# Altium project B108AA.PrjPcb (part 4 of 4)

## Sheet MicroController USB to UART Converter.SchDoc: USB to UART Converter
size 292 x 193 mm; SheetNumber: 39; SheetTotal: 40
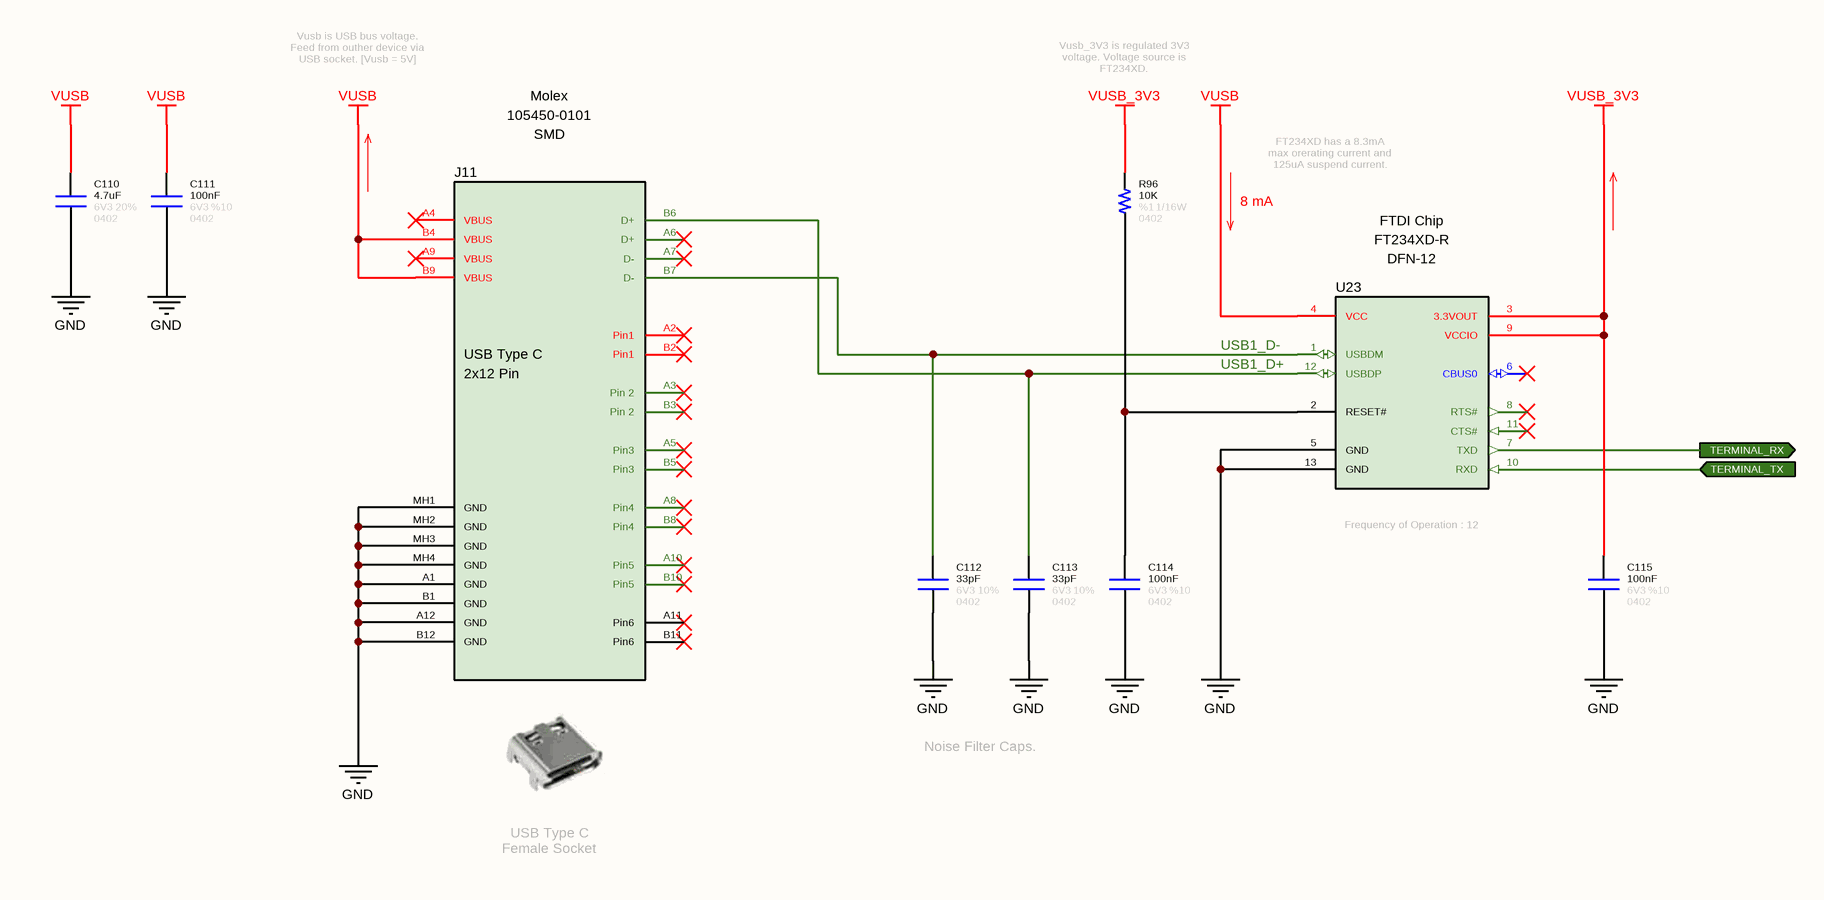
[diagram p39: MicroController USB to UART Converter.SchDoc]

### Parts
C110  value 4.7uF  Tolerance: 20%  Case: 0402  Voltage: 6V3  [CAPACITOR_0402]  (hidden comment: Capacitor - 4.7uF [0402] (Ceramic))
C111  value 100nF  Tolerance: %10  Voltage: 6V3  Case: 0402  [CAPACITOR_0402]  (hidden comment: Capacitor - 100nF [0402] (Ceramic))
C112  value 33pF  Tolerance: 10%  Case: 0402  Voltage: 6V3  [CAPACITOR_0402]  (hidden comment: Capacitor - 33pF [0402] (Ceramic))
C113  value 33pF  Tolerance: 10%  Case: 0402  Voltage: 6V3  [CAPACITOR_0402]  (hidden comment: Capacitor - 33pF [0402] (Ceramic))
C114  value 100nF  Tolerance: %10  Voltage: 6V3  Case: 0402  [CAPACITOR_0402]  (hidden comment: Capacitor - 100nF [0402] (Ceramic))
C115  value 100nF  Tolerance: %10  Voltage: 6V3  Case: 0402  [CAPACITOR_0402]  (hidden comment: Capacitor - 100nF [0402] (Ceramic))
J11  Manufacturer Name: Molex  Case: SMD  [USB Type C - Molex 105450-0101]  (hidden comment: 105450-0101)
R96  value 10K  Tolerance: %1  Case: 0402  Power: 1/16W  [RESISTOR_0402]  (hidden comment: 10K - 0402 - %1 - 1/16W)
U23  Manufacturer Name: FTDI Chip  Case: DFN-12  [FT234XD-R]  (hidden comment: FT234XD-R)

### Ports
TERMINAL_RX (out), TERMINAL_TX (in)

### Nets
GND: C110.1 C111.1 C112.1 C113.1 C114.1 C115.1 J11.A1(GND) J11.A12(GND) J11.B1(GND) J11.B12(GND) J11.MH1(GND) J11.MH2(GND) J11.MH3(GND) J11.MH4(GND) U23.5(GND) U23.13(GND)
VUSB: C110.2 C111.2 J11.B4(VBUS) J11.B9(VBUS) U23.4(VCC)
VUSB_3V3: C115.2 R96.2 U23.3(3.3VOUT) U23.9(VCCIO)
USB1_D+: C113.2 J11.B6(D+) U23.12(USBDP)
USB1_D-: C112.2 J11.B7(D-) U23.1(USBDM)
NetC114_2: C114.2 R96.1 U23.2(RESET#)
NetU13_2: U23.7(TXD) ; port TERMINAL_RX
NetU13_3: U23.10(RXD) ; port TERMINAL_TX

Not connected (* = marked no-connect by the designer): J11 A2(Pin1)* A3(Pin_2)* A4(VBUS)* A5(Pin3)* A6(D+)* A7(D-)* A8(Pin4)* A9(VBUS)* A10(Pin5)* A11(Pin6)* B2(Pin1)* B3(Pin_2)* B5(Pin3)* B8(Pin4)* B10(Pin5)* B11(Pin6)*; U23 6(CBUS0)* 8(RTS#)* 11(CTS#)*

### Notes on the sheet
- Vusb is USB bus voltage. Feed from outher device via USB socket. [Vusb = 5V]
- Vusb_3V3 is regulated 3V3 voltage. Voltage source is FT234XD.
- 8 mA
- FT234XD has a 8.3mA max orerating current and 125uA suspend current.
- (near U23) Frequency of Operation : 12 MHz
- Noise Filter Caps.
- USB Type C
  Female Socket
- © 2022 All rights reserved.
  This document may not, in whole or in part, be copied, photocopied, reproduced, translated or converted to any electronic or machine readable from without prior written permission of Mehmet Günce Akkoyun.
  Engineer contact : akkoyun@me.com
- Property of
- Engineer :
- Date :
- Size :
- A4
- Time :
- Project :
- Page :
- /
- Customer :
- Product ID :
- Module ID :
- Version :
- File :
- Revision :
- (in symbol Connector - USB Type C SMD Connector) USB Type C; 2x12 Pin

### Library data of the parts
C110 = Capacitor - 4.7uF [0402-6V3]: Multilayer Ceramic Capacitors - SMD - 6V3 4.7uF X5R 0402 20%; Manufacturer Part Number: C0402C475M9PACTU; Manufacturer Name: KEMET
C111 C114 C115 = Capacitor - 100nF [0402-6V3]: Capacitor - 100nF [0402-6V3] (Ceramic); Manufacturer Name: AVX; Manufacturer Part Number: 04026D104KAT4A; ComponentLink1Description: Mouser; ComponentLink1URL: https://www.mouser.com.tr/ProductDetail/AVX/04026D104KAT4A?qs=sGAEpiMZZMs0AnBnWHyRQPg4iYkCw7IMED%2F4kpqgf7w%3D; ComponentLink2Description: DataSheet; ComponentLink2URL: https://www.mouser.com.tr/datasheet/2/40/cx5r-776519.pdf
C112 C113 = Capacitor - 33pF [0402-6V3]: Manufacturer Name: Kemet; Manufacturer Part Number: C0402C330J9RACAUTO; ComponentLink1Description: DataSheet; ComponentLink1URL: https://api.kemet.com/component-edge/download/datasheet/C0402C330J9RACAUTO.pdf; ComponentLink2Description: Mouser; ComponentLink2URL: https://www.mouser.com/Search/Refine.aspx?Keyword=80-C0402C330J9RAUTO
J11 = Connector - USB Type C SMD Connector: USB Shielded I/O Receptacle; Type C; Right Angle; Surface Mount; Gold over Nickel; Current Rating: 5 A.; Gender: Jack (Female); Number of Contacts: 24 Contact; Voltage Rating: 30 V; Maximum Operating Temperature: + 85 C; Minimum Operating Temperature: - 30 C; Mounting Angle: Right Angle; Product Type: USB Connectors; RoHS: Yes; Manufacturer Part Number: 105450-0101
R96 = Resistor - 10K [0402]: Thick Film Resistors - SMD 1/16 W 10 KOhm 1%; Manufacturer Name: Vishay; Manufacturer Part Number: CRCW040210K0FKED; ComponentLink1Description: DataSheet; ComponentLink1URL: https://www.mouser.com.tr/datasheet/2/427/dcrcwe3-1762152.pdf; ComponentLink2Description: Mouser; ComponentLink2URL: https://www.mouser.com.tr/ProductDetail/Vishay-Dale/CRCW040210K0FKED?qs=sGAEpiMZZMu61qfTUdNhG2DpbjADlD3GcalbOv9utCY%3D
U23 = IC - FT234XD-R: USB Interface IC USB to Serial UART Interface; Data Rate: 12 Mb/s; Interface Type: UART, USB; Number of Ports: 1 Port; Maximum Operating Temperature: + 85 C; Minimum Operating Temperature: - 40 C; Product Type: USB Interface IC; RoHS: Yes; Manufacturer Part Number: FT234XD-R

## Sheet MicroController RGB LED.SchDoc: RGB LED
size 292 x 193 mm; SheetNumber: 40; SheetTotal: 40
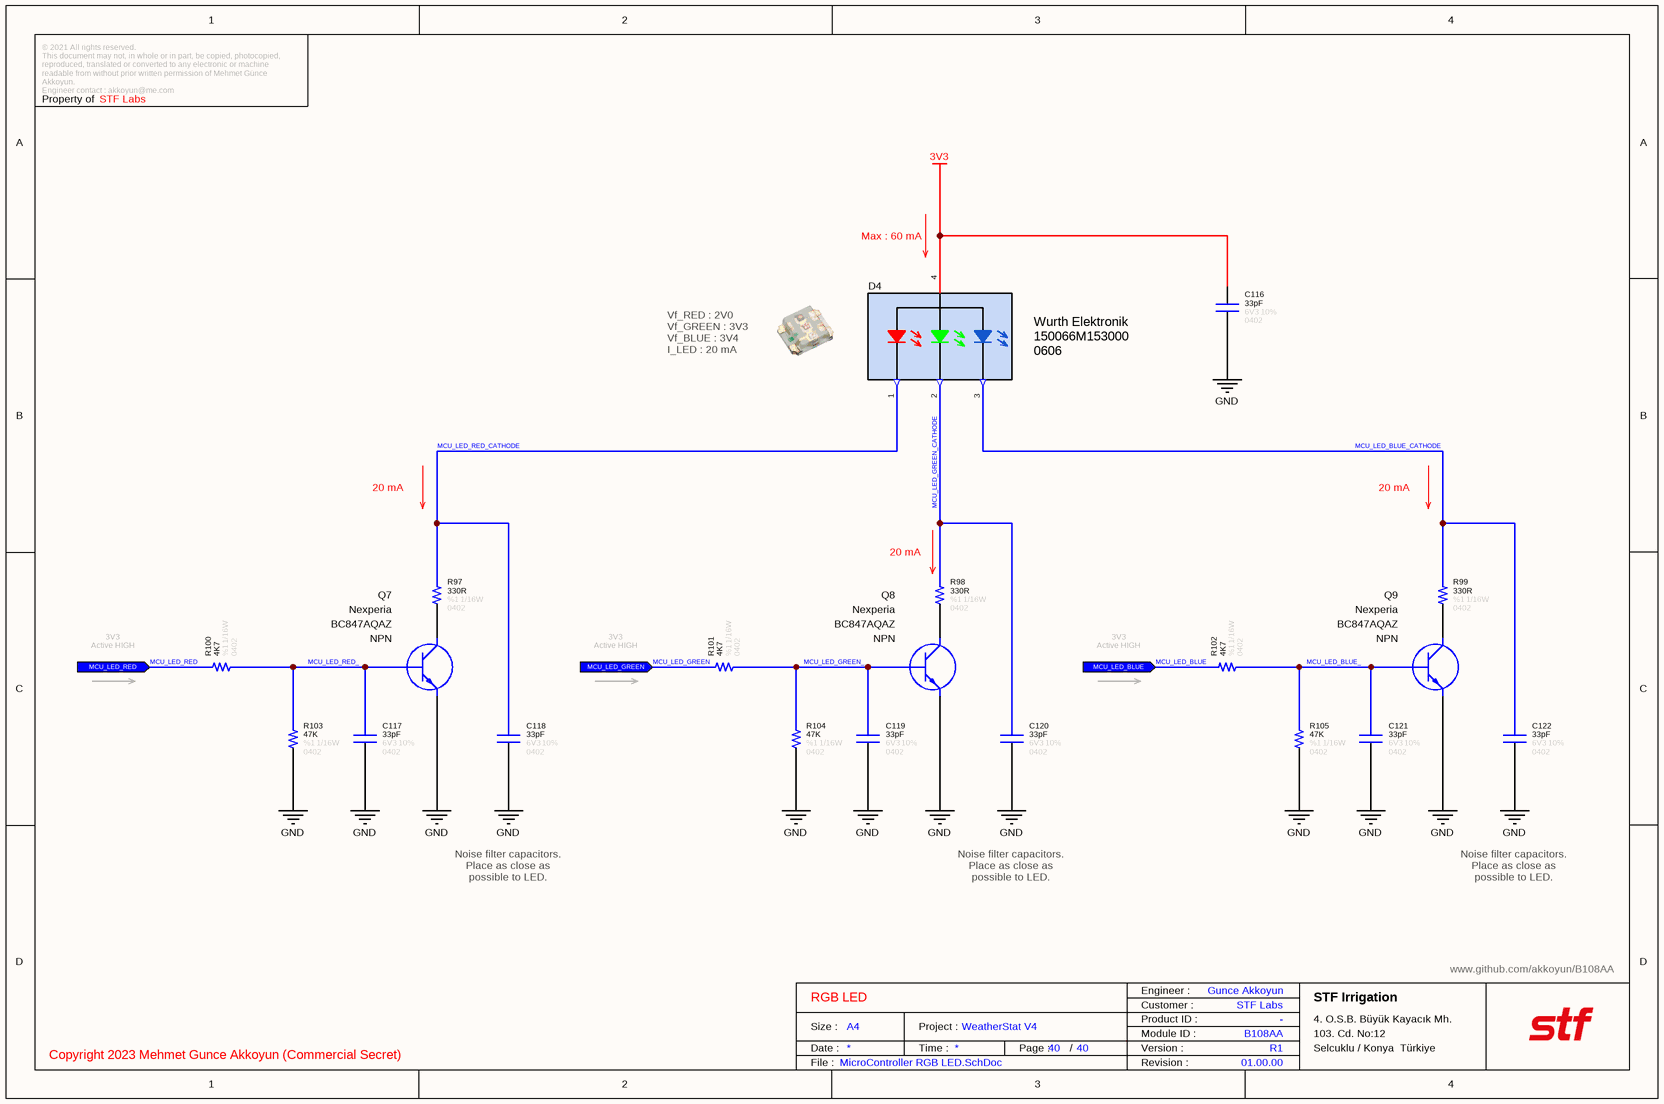
[diagram p40: MicroController RGB LED.SchDoc]

### Parts
C116  value 33pF  Tolerance: 10%  Case: 0402  Voltage: 6V3  [CAPACITOR_0402]  (hidden comment: Capacitor - 33pF [0402] (Ceramic))
C117  value 33pF  Tolerance: 10%  Case: 0402  Voltage: 6V3  [CAPACITOR_0402]  (hidden comment: Capacitor - 33pF [0402] (Ceramic))
C118  value 33pF  Tolerance: 10%  Case: 0402  Voltage: 6V3  [CAPACITOR_0402]  (hidden comment: Capacitor - 33pF [0402] (Ceramic))
C119  value 33pF  Tolerance: 10%  Case: 0402  Voltage: 6V3  [CAPACITOR_0402]  (hidden comment: Capacitor - 33pF [0402] (Ceramic))
C120  value 33pF  Tolerance: 10%  Case: 0402  Voltage: 6V3  [CAPACITOR_0402]  (hidden comment: Capacitor - 33pF [0402] (Ceramic))
C121  value 33pF  Tolerance: 10%  Case: 0402  Voltage: 6V3  [CAPACITOR_0402]  (hidden comment: Capacitor - 33pF [0402] (Ceramic))
C122  value 33pF  Tolerance: 10%  Case: 0402  Voltage: 6V3  [CAPACITOR_0402]  (hidden comment: Capacitor - 33pF [0402] (Ceramic))
D4  Manufacturer Name: Wurth Elektronik  Case: 0606  [Wurth_0606]  (hidden comment: 150066M153000)
Q7  Manufacturer Name: Nexperia  Polarity: NPN  [SOT1215]  (hidden comment: BC847AQAZ)
Q8  Manufacturer Name: Nexperia  Polarity: NPN  [SOT1215]  (hidden comment: BC847AQAZ)
Q9  Manufacturer Name: Nexperia  Polarity: NPN  [SOT1215]  (hidden comment: BC847AQAZ)
R97  value 330R  Case: 0402  Tolerance: %1  Power: 1/16W  [RESISTOR_0402]  (hidden comment: 330R - 0402 - %1 - 1/16W)
R98  value 330R  Case: 0402  Tolerance: %1  Power: 1/16W  [RESISTOR_0402]  (hidden comment: 330R - 0402 - %1 - 1/16W)
R99  value 330R  Case: 0402  Tolerance: %1  Power: 1/16W  [RESISTOR_0402]  (hidden comment: 330R - 0402 - %1 - 1/16W)
R100  value 4K7  Tolerance: %1  Case: 0402  Power: 1/16W  [RESISTOR_0402]  (hidden comment: 4K7 - 0402 - %1 - 1/16W)
R101  value 4K7  Tolerance: %1  Case: 0402  Power: 1/16W  [RESISTOR_0402]  (hidden comment: 4K7 - 0402 - %1 - 1/16W)
R102  value 4K7  Tolerance: %1  Case: 0402  Power: 1/16W  [RESISTOR_0402]  (hidden comment: 4K7 - 0402 - %1 - 1/16W)
R103  value 47K  Tolerance: %1  Case: 0402  Power: 1/16W  [RESISTOR_0402]  (hidden comment: 47K - 0402 - %1 - 1/16W)
R104  value 47K  Tolerance: %1  Case: 0402  Power: 1/16W  [RESISTOR_0402]  (hidden comment: 47K - 0402 - %1 - 1/16W)
R105  value 47K  Tolerance: %1  Case: 0402  Power: 1/16W  [RESISTOR_0402]  (hidden comment: 47K - 0402 - %1 - 1/16W)

### Ports
MCU_LED_BLUE (in), MCU_LED_GREEN (in), MCU_LED_RED (in)

### Nets
3V3: C116.2 D4.4
GND: C116.1 C117.1 C118.1 C119.1 C120.1 C121.1 C122.1 Q7.2(E) Q8.2(E) Q9.2(E) R103.1 R104.1 R105.1
MCU_LED_BLUE: R102.2 ; port MCU_LED_BLUE
MCU_LED_BLUE_: C121.2 Q9.1(B) R102.1 R105.2
MCU_LED_BLUE_CATHODE: C122.2 D4.3 R99.2
MCU_LED_GREEN: R101.2 ; port MCU_LED_GREEN
MCU_LED_GREEN_: C119.2 Q8.1(B) R101.1 R104.2
MCU_LED_GREEN_CATHODE: C120.2 D4.2 R98.2
MCU_LED_RED: R100.2 ; port MCU_LED_RED
MCU_LED_RED_: C117.2 Q7.1(B) R100.1 R103.2
MCU_LED_RED_CATHODE: C118.2 D4.1 R97.2
NetQ7_3: Q7.3(C) R97.1
NetQ8_3: Q8.3(C) R98.1
NetQ9_3: Q9.3(C) R99.1

### Notes on the sheet
- (near D4) Max : 60 mA
- Vf_RED : 2V0
  Vf_GREEN : 3V3
  Vf_BLUE : 3V4
  I_LED : 20 mA
- 20 mA
- (near R98) 20 mA
- 3V3
  Active HIGH
- Noise filter capacitors. Place as close as possible to LED.
- © 2021 All rights reserved.
  This document may not, in whole or in part, be copied, photocopied, reproduced, translated or converted to any electronic or machine readable from without prior written permission of Mehmet Günce Akkoyun.
  Engineer contact : akkoyun@me.com
- Property of
- Engineer :
- Date :
- Size :
- A4
- Time :
- Project :
- Page :
- /
- Customer :
- Product ID :
- Module ID :
- Version :
- File :
- Revision :

### Library data of the parts
C116-C122 = Capacitor - 33pF [0402-6V3]: as C112 on sheet MicroController USB to UART Converter; ComponentLink1Description: DataSheet; ComponentLink1URL: https://api.kemet.com/component-edge/download/datasheet/C0402C330J9RACAUTO.pdf; ComponentLink2Description: Mouser; ComponentLink2URL: https://www.mouser.com/Search/Refine.aspx?Keyword=80-C0402C330J9RAUTO
D4 = Diode - LED-RGB: LED RGB DIFFUSED SMD; If - Forward Current: 20 mA; Vf - Forward Voltage: 2 V, 3.3 V; Product Type: LED; Minimum Operating Temperature: - 40 C; Maximum Operating Temperature: + 85 C; ROHS: Yes; Manufacturer Part Number: 150066M153000
Q7-Q9 = Transistor - BC847: Bipolar NPN Transistors; Case: DFN-1010D-3; Manufacturer Part Number: BC847AQAZ
R97-R99 = Resistor - 330R [0402]: Thick Film Resistors - SMD 1/16 W 330 Ohm 1%; Manufacturer Name: Vishay; Manufacturer Part Number: CRCW0402330RFKED; ComponentLink1Description: DataSheet; ComponentLink1URL: https://www.mouser.com.tr/datasheet/2/427/dcrcwe3-1762152.pdf; ComponentLink2Description: Mouser; ComponentLink2URL: https://www.mouser.com.tr/ProductDetail/Vishay-Dale/CRCW0402330RFKED?qs=sGAEpiMZZMu61qfTUdNhG2DpbjADlD3GGS6SwBlLi5Q%3D
R100-R102 = Resistor - 4K7 [0402]: Thick Film Resistors - SMD 1/16 W 4.7 KOhm 1%; Manufacturer Name: Vishay; Manufacturer Part Number: CRCW04024K70FKED; ComponentLink1Description: DataSheet; ComponentLink1URL: https://www.mouser.com.tr/datasheet/2/427/dcrcwe3-1762152.pdf; ComponentLink2Description: Mouser; ComponentLink2URL: https://www.mouser.com.tr/ProductDetail/Vishay-Dale/CRCW04024K70FKED?qs=sGAEpiMZZMu61qfTUdNhG7nHf%2F6MTUn3HadIdDQu24Q%3D
R103-R105 = Resistor - 47K [0402]: Thick Film Resistors - SMD 1/16 W 47 KOhm 1%; Manufacturer Name: Vishay; Manufacturer Part Number: CRCW040247K0FKED; ComponentLink1Description: DataSheet; ComponentLink1URL: https://www.mouser.com.tr/datasheet/2/427/dcrcwe3-1762152.pdf; ComponentLink2Description: Mouser; ComponentLink2URL: https://www.mouser.com.tr/ProductDetail/Vishay-Dale/CRCW040247K0FKED?qs=sGAEpiMZZMu61qfTUdNhG2DpbjADlD3GL%252B3h1elTxqU%3D

## Nets that join several sheets
3V3: RS485 Channel 1 (C5.2 R4.2 U2.8), RS485 Channel 2 (C9.2 R11.2 U3.8), RS485 Channel 3 (C13.2 R18.2 U4.8), RS485 Channel 4 (C17.2 R25.2 U5.8), RS485 UART Multiplexer (C1.2 R1.2 U1.16), I2C Network (R107.2 R108.2), I2C Multiplexer (5 pins), I2C DP Sensor 1 (C27.2 R46.2 R47.2 U10.2), I2C DP Sensor 2 (C28.2 R48.2 R49.2 U11.2), I2C DP Sensor 3 (C29.2 R50.2 R51.2 U12.2), I2C Air Pressure Sensor (5 pins), I2C TH Sensor Socket (J5.1 R40.2 R41.2), I2C UV Sensor (6 pins), I2C Serial ID (C23.2 R38.2 R39.2 U7.5), Power 3V3 Regulator (C59.2 C123.2 TP3.1 U18.2), GSM Voltage Translator (C68.2 R73.2 R74.2 U21.1), GSM Status LED Driver (C88.2 D1.2), GSM PPS LED Driver (C91.2 D2.2), GSM Power LED Driver (C109.2 D3.2), MicroController Core (12 pins), MicroController RGB LED (C116.2 D4.4)
3V8: GSM Power Source (8 pins), GNSS Antenna (C92.2 C93.2 U22.1)
5V: RS485 Channel 1 (J1.1 R5.2), RS485 Channel 2 (J2.1 R12.2), RS485 Channel 3 (J3.1 R19.2), RS485 Channel 4 (J4.1 R26.2), Power 5V Boost Converter (10 pins), Power 3V3 Regulator (C51.2 U24.1), GSM Power Source (U19.5)
BAT+: Power Battery Measurement (5 pins), Power Battery Charger (U15.13 U15.14)
GND: RS485 Channel 1 (12 pins), RS485 Channel 2 (12 pins), RS485 Channel 3 (12 pins), RS485 Channel 4 (12 pins), RS485 UART Multiplexer (8 pins), I2C Multiplexer (6 pins), I2C DP Sensor 1 (C27.1 U10.3), I2C DP Sensor 2 (C28.1 U11.3), I2C DP Sensor 3 (C29.1 U12.3), I2C Air Pressure Sensor (C25.1 C26.1 U9.3), I2C TH Sensor Socket (J5.4 J5.5 J5.6), I2C UV Sensor (C24.1 U8.8), I2C Serial ID (C23.1 U7.2), Power Battery Measurement (R52.1 U14.5), Power Battery Charger (17 pins), Power 5V Boost Converter (17 pins), Power 3V3 Regulator (8 pins), Power Sleep Timer (10 pins), GSM Voltage Translator (20 pins), GSM Modem Antenna (5 pins), GSM Status LED Driver (5 pins), GSM SIM Socket (9 pins), GSM Power Source (58 pins), GNSS Antenna (9 pins), GSM PPS LED Driver (5 pins), GSM On-Off Signal Control (C96.1 Q3.2 R89.1), GSM Shut Down Signal Control (C97.1 Q4.2 R91.1), GSM GNSS En Signal Control (C98.1 Q5.2 R93.1), GSM Power LED Driver (C108.1 C109.1 Q6.2), GSM USB Port (8 pins), MicroController Core (20 pins), MicroController USB to UART Converter (16 pins), MicroController RGB LED (13 pins)
GSM_1V8: GSM Voltage Translator (6 pins), GSM Power LED Driver (Q6.1)
VCC: Power Battery Charger (7 pins), Power 5V Boost Converter (5 pins), Power Sleep Timer (C55.2 J7.1 R65.2 U17.1)
3V3_EN: Power 3V3 Regulator (C124.2 R106.2 TP23.1 U24.3), Power Sleep Timer (C57.2 R69.2 U17.5)
DONE: Block Diagram (U13.51), Power Sleep Timer (C56.2 R68.2 U17.4)
~{GSM_1V8_GNSS_EN}: GSM Signal Block Diagram (U20.G14), GSM GNSS En Signal Control (Q5.3)
~{GSM_1V8_ONOFF}: GSM Signal Block Diagram (U20.R12), GSM On-Off Signal Control (Q3.3)
~{GSM_1V8_SDOWN}: GSM Signal Block Diagram (U20.R13), GSM Shut Down Signal Control (Q4.3)
~{GSM_COMM_EN}: Block Diagram (U13.77), GSM Voltage Translator (C75.2 R73.1 TP11.1 U21.22)
GSM_GNSS_EN: Block Diagram (U13.74), GSM GNSS En Signal Control (R92.2)
GSM_ONOFF: Block Diagram (U13.76), GSM On-Off Signal Control (R88.2)
GSM_PMON: Block Diagram (U13.65), GSM Voltage Translator (C70.2 R75.2 TP8.1 U21.3)
GSM_POWER_EN: Block Diagram (U13.78), GSM Power Source (C62.2 R71.2 TP5.1 U19.4)
GSM_RING: Block Diagram (U13.66), GSM Voltage Translator (C72.2 R77.2 TP10.1 U21.5)
GSM_RX: Block Diagram (U13.64), GSM Voltage Translator (C74.2 TP7.1 U21.7)
GSM_SDOWN: Block Diagram (U13.75), GSM Shut Down Signal Control (R90.2)
GSM_SWREADY: Block Diagram (U13.67), GSM Voltage Translator (C71.2 R76.2 TP9.1 U21.4)
GSM_TX: Block Diagram (U13.63), GSM Voltage Translator (C73.2 TP6.1 U21.6)
I2C_CH0_SCL: I2C Multiplexer (U6.5), I2C Serial ID (R38.1 U7.1)
I2C_CH0_SDA: I2C Multiplexer (U6.4), I2C Serial ID (R39.1 U7.3)
I2C_CH1_SCL: I2C Multiplexer (U6.7), I2C TH Sensor Socket (J5.2 R40.1)
I2C_CH1_SDA: I2C Multiplexer (U6.6), I2C TH Sensor Socket (J5.3 R41.1)
I2C_CH2_SCL: I2C Multiplexer (U6.9), I2C UV Sensor (R42.1 U8.2)
I2C_CH2_SDA: I2C Multiplexer (U6.8), I2C UV Sensor (R43.1 U8.1)
I2C_CH3_SCL: I2C Multiplexer (U6.11), I2C Air Pressure Sensor (R44.1 U9.8)
I2C_CH3_SDA: I2C Multiplexer (U6.10), I2C Air Pressure Sensor (R45.1 U9.7)
I2C_CH4_SCL: I2C Multiplexer (U6.14), I2C DP Sensor 3 (R50.1 U12.1)
I2C_CH4_SDA: I2C Multiplexer (U6.13), I2C DP Sensor 3 (R51.1 U12.4)
I2C_CH5_SCL: I2C Multiplexer (U6.16), I2C DP Sensor 2 (R48.1 U11.1)
I2C_CH5_SDA: I2C Multiplexer (U6.15), I2C DP Sensor 2 (R49.1 U11.4)
I2C_CH6_SCL: I2C Multiplexer (U6.18), I2C DP Sensor 1 (R46.1 U10.1)
I2C_CH6_SDA: I2C Multiplexer (U6.17), I2C DP Sensor 1 (R47.1 U10.4)
I2C_CH7_SCL: I2C Network (R107.1), I2C Multiplexer (U6.20), Power Battery Measurement (U14.3), Power Battery Charger (U15.5)
I2C_CH7_SDA: I2C Network (R108.1), I2C Multiplexer (U6.19), Power Battery Measurement (U14.4), Power Battery Charger (U15.6)
I2C_SCL: Block Diagram (U13.43), I2C Multiplexer (R32.1 U6.22)
I2C_SDA: Block Diagram (U13.44), I2C Multiplexer (R33.1 U6.23)
MCU_LED_BLUE: Block Diagram (U13.87), MicroController RGB LED (R102.2)
MCU_LED_GREEN: Block Diagram (U13.88), MicroController RGB LED (R101.2)
MCU_LED_RED: Block Diagram (U13.89), MicroController RGB LED (R100.2)
NetU13_2: Block Diagram (U13.2), MicroController USB to UART Converter (U23.7)
NetU13_3: Block Diagram (U13.3), MicroController USB to UART Converter (U23.10)
~{RS485_MUX_EN}: Block Diagram (U13.50), RS485 UART Multiplexer (C2.2 R1.1 U1.6)
RS485_DIR_1: Block Diagram (U13.58), RS485 Channel 1 (C6.2 R7.2 U2.2 U2.3)
RS485_DIR_2: Block Diagram (U13.55), RS485 Channel 2 (C10.2 R14.2 U3.2 U3.3)
RS485_DIR_3: Block Diagram (U13.57), RS485 Channel 3 (C14.2 R21.2 U4.2 U4.3)
RS485_DIR_4: Block Diagram (U13.56), RS485 Channel 4 (C18.2 R28.2 U5.2 U5.3)
RS485_EN_1: Block Diagram (U13.59), RS485 Channel 1 (C8.2 J1.5 R10.2)
RS485_EN_2: Block Diagram (U13.54), RS485 Channel 2 (C12.2 J2.5 R17.2)
RS485_EN_3: Block Diagram (U13.60), RS485 Channel 3 (C16.2 J3.5 R24.2)
RS485_EN_4: Block Diagram (U13.53), RS485 Channel 4 (C20.2 J4.5 R31.2)
RS485_MUX_A: Block Diagram (U13.49), RS485 UART Multiplexer (C3.2 R2.2 U1.10)
RS485_MUX_B: Block Diagram (U13.48), RS485 UART Multiplexer (C4.2 R3.2 U1.9)
RS485_RX: Block Diagram (U13.45), RS485 UART Multiplexer (U1.3)
RS485_RX_1: RS485 Channel 1 (U2.4), RS485 UART Multiplexer (U1.12)
RS485_RX_2: RS485 Channel 2 (U3.4), RS485 UART Multiplexer (U1.14)
RS485_RX_3: RS485 Channel 3 (U4.4), RS485 UART Multiplexer (U1.15)
RS485_RX_4: RS485 Channel 4 (U5.4), RS485 UART Multiplexer (U1.11)
RS485_SENSE_1: Block Diagram (U13.35), RS485 Channel 1 (C7.2 J1.2 R9.2)
RS485_SENSE_2: Block Diagram (U13.36), RS485 Channel 2 (C11.2 J2.2 R16.2)
RS485_SENSE_3: Block Diagram (U13.37), RS485 Channel 3 (C15.2 J3.2 R23.2)
RS485_SENSE_4: Block Diagram (U13.38), RS485 Channel 4 (C19.2 J4.2 R30.2)
RS485_TX: Block Diagram (U13.46), RS485 UART Multiplexer (U1.13)
RS485_TX_1: RS485 Channel 1 (R4.1 U2.1), RS485 UART Multiplexer (U1.1)
RS485_TX_2: RS485 Channel 2 (R11.1 U3.1), RS485 UART Multiplexer (U1.5)
RS485_TX_3: RS485 Channel 3 (R18.1 U4.1), RS485 UART Multiplexer (U1.2)
RS485_TX_4: RS485 Channel 4 (R25.1 U5.1), RS485 UART Multiplexer (U1.4)